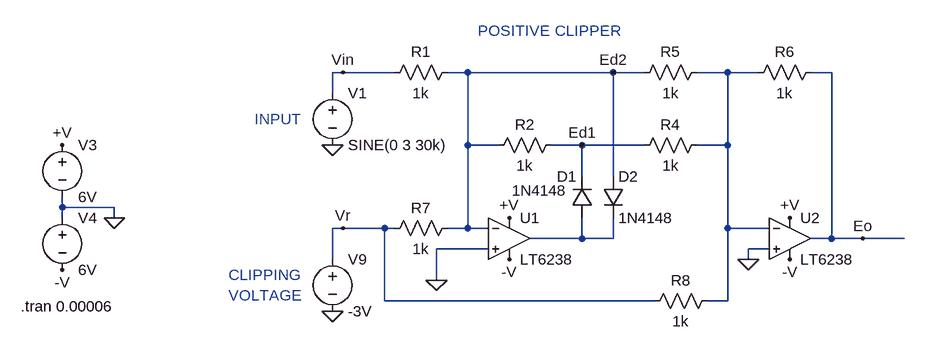
[diagram p0: schematic Positive clipper.asc]
Positive clipper.asc, the LTspice schematic file:
Version 4
SHEET 1 4424 696
WIRE 560 -512 544 -512
WIRE 640 -512 560 -512
WIRE 752 -512 720 -512
WIRE 976 -512 752 -512
WIRE 1024 -512 976 -512
WIRE 1152 -512 1104 -512
WIRE 1200 -512 1152 -512
WIRE 1312 -512 1280 -512
WIRE 544 -480 544 -512
WIRE 752 -400 752 -512
WIRE 800 -400 752 -400
WIRE 928 -400 880 -400
WIRE 1024 -400 928 -400
WIRE 1152 -400 1152 -512
WIRE 1152 -400 1104 -400
WIRE 928 -352 928 -400
WIRE 976 -352 976 -512
WIRE 128 -304 128 -320
WIRE 208 -304 128 -304
WIRE 128 -288 128 -304
WIRE 208 -288 208 -304
WIRE 560 -272 544 -272
WIRE 624 -272 560 -272
WIRE 640 -272 624 -272
WIRE 752 -272 752 -400
WIRE 752 -272 720 -272
WIRE 784 -272 752 -272
WIRE 1152 -272 1152 -400
WIRE 1216 -272 1152 -272
WIRE 928 -256 928 -288
WIRE 928 -256 848 -256
WIRE 976 -256 976 -288
WIRE 976 -256 928 -256
WIRE 1312 -256 1312 -512
WIRE 1312 -256 1280 -256
WIRE 1360 -256 1312 -256
WIRE 1424 -256 1360 -256
WIRE 784 -240 704 -240
WIRE 1216 -240 1184 -240
WIRE 544 -224 544 -272
WIRE 1184 -224 1184 -240
WIRE 704 -192 704 -240
WIRE 624 -160 624 -272
WIRE 1040 -160 624 -160
WIRE 1152 -160 1152 -272
WIRE 1152 -160 1120 -160
FLAG 544 -400 0
FLAG 816 -288 +V
FLAG 816 -224 -V
FLAG 704 -192 0
FLAG 1248 -288 +V
FLAG 1248 -224 -V
FLAG 1184 -224 0
FLAG 544 -144 0
FLAG 560 -512 Vin
FLAG 208 -288 0
FLAG 128 -400 +V
FLAG 128 -208 -V
FLAG 1360 -256 Eo
FLAG 928 -400 Ed1
FLAG 976 -512 Ed2
FLAG 560 -272 Vr
SYMBOL voltage 544 -496 R0
WINDOW 123 0 0 Left 0
WINDOW 39 0 0 Left 0
SYMATTR InstName V1
SYMATTR Value SINE(0 3 30k)
SYMBOL diode 944 -288 R180
WINDOW 0 24 64 Left 2
WINDOW 3 39 42 Left 2
SYMATTR InstName D1
SYMATTR Value 1N4148
SYMBOL diode 960 -352 R0
SYMATTR InstName D2
SYMATTR Value 1N4148
SYMBOL res 1120 -416 R90
WINDOW 0 0 56 VBottom 2
WINDOW 3 32 56 VTop 2
SYMATTR InstName R4
SYMATTR Value 1k
SYMBOL res 1120 -528 R90
WINDOW 0 0 56 VBottom 2
WINDOW 3 32 56 VTop 2
SYMATTR InstName R5
SYMATTR Value 1k
SYMBOL res 896 -416 R90
WINDOW 0 0 56 VBottom 2
WINDOW 3 32 56 VTop 2
SYMATTR InstName R2
SYMATTR Value 1k
SYMBOL res 736 -528 R90
WINDOW 0 0 56 VBottom 2
WINDOW 3 32 56 VTop 2
SYMATTR InstName R1
SYMATTR Value 1k
SYMBOL res 736 -288 R90
WINDOW 0 0 56 VBottom 2
WINDOW 3 32 56 VTop 2
SYMATTR InstName R7
SYMATTR Value 1k
SYMBOL res 1136 -176 R90
WINDOW 0 0 56 VBottom 2
WINDOW 3 32 56 VTop 2
SYMATTR InstName R8
SYMATTR Value 1k
SYMBOL res 1296 -528 R90
WINDOW 0 0 56 VBottom 2
WINDOW 3 32 56 VTop 2
SYMATTR InstName R6
SYMATTR Value 1k
SYMBOL voltage 544 -240 R0
WINDOW 123 0 0 Left 0
WINDOW 39 0 0 Left 0
SYMATTR InstName V9
SYMATTR Value -3V
SYMBOL Opamps\\LT6238 816 -256 R0
SYMATTR InstName U1
SYMBOL voltage 128 -416 R0
WINDOW 123 0 0 Left 0
WINDOW 39 0 0 Left 0
SYMATTR InstName V3
SYMATTR Value 6V
SYMBOL voltage 128 -304 R0
WINDOW 123 0 0 Left 0
WINDOW 39 0 0 Left 0
SYMATTR InstName V4
SYMATTR Value 6V
SYMBOL Opamps\\LT6238 1248 -256 R0
SYMATTR InstName U2
TEXT 64 -152 Left 2 !.tran 0.00006
TEXT 768 -576 Left 2 ;POSITIVE CLIPPER
TEXT 424 -440 Left 2 ;INPUT
TEXT 384 -200 Left 2 ;CLIPPING\nVOLTAGE

The netlist it stands for:
* Positive clipper.asc
V1 Vin 0 SINE(0 3 30k)
D1 N002 Ed1 1N4148
D2 Ed2 N002 1N4148
R4 N001 Ed1 1k
R5 N001 Ed2 1k
R2 Ed1 Ed2 1k
R1 Ed2 Vin 1k
R7 Ed2 Vr 1k
R8 N001 Vr 1k
R6 Eo N001 1k
V9 Vr 0 -3V
* U1: LT6238 (symbol Opamps\LT6238 not available, pins judged from their places): In+=0 In-=Ed2 V+=+V V-=-V OUT=N002
V3 +V 0 6V
V4 0 -V 6V
* U2: LT6238 (symbol Opamps\LT6238 not available, pins judged from their places): In+=0 In-=N001 V+=+V V-=-V OUT=Eo
.model D D
.lib standard.dio
.tran 0.00006
* POSITIVE CLIPPER
* INPUT
* CLIPPING
* VOLTAGE
.backanno
.end